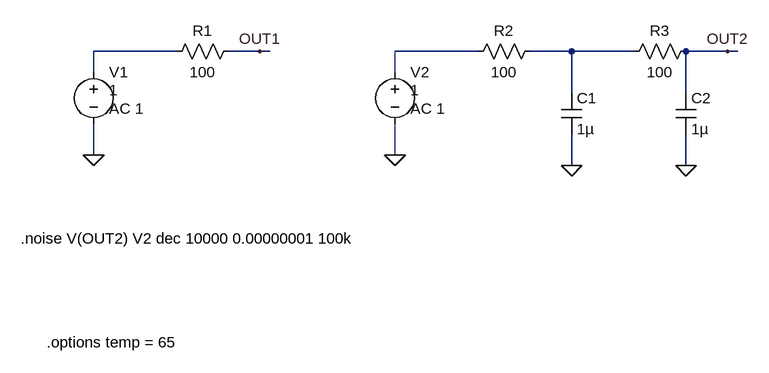
[diagram p0: schematic ask2_2.asc]
ask2_2.asc, the LTspice schematic file:
Version 4
SHEET 1 1024 680
WIRE 128 112 0 112
WIRE 256 112 208 112
WIRE 272 112 256 112
WIRE 592 112 464 112
WIRE 736 112 672 112
WIRE 832 112 736 112
WIRE 976 112 912 112
WIRE 992 112 976 112
WIRE 0 144 0 112
WIRE 464 144 464 112
WIRE 736 176 736 112
WIRE 912 176 912 112
WIRE 0 272 0 224
WIRE 464 272 464 224
WIRE 736 288 736 240
WIRE 912 288 912 240
FLAG 256 112 OUT1
FLAG 0 272 0
FLAG 464 272 0
FLAG 976 112 OUT2
FLAG 736 288 0
FLAG 912 288 0
SYMBOL voltage 0 128 R0
WINDOW 3 24 44 Left 2
WINDOW 123 24 72 Left 2
WINDOW 39 0 0 Left 0
SYMATTR InstName V1
SYMATTR Value 1
SYMATTR Value2 AC 1
SYMBOL res 224 96 R90
WINDOW 0 0 56 VBottom 2
WINDOW 3 32 56 VTop 2
SYMATTR InstName R1
SYMATTR Value 100
SYMBOL voltage 464 128 R0
WINDOW 3 24 44 Left 2
WINDOW 123 24 72 Left 2
WINDOW 39 0 0 Left 0
SYMATTR InstName V2
SYMATTR Value 1
SYMATTR Value2 AC 1
SYMBOL res 688 96 R90
WINDOW 0 0 56 VBottom 2
WINDOW 3 32 56 VTop 2
SYMATTR InstName R2
SYMATTR Value 100
SYMBOL cap 720 176 R0
SYMATTR InstName C1
SYMATTR Value 1µ
SYMBOL res 928 96 R90
WINDOW 0 0 56 VBottom 2
WINDOW 3 32 56 VTop 2
SYMATTR InstName R3
SYMATTR Value 100
SYMBOL cap 896 176 R0
SYMATTR InstName C2
SYMATTR Value 1µ
TEXT -112 400 Left 2 !.noise V(OUT2) V2 dec 10000 0.00000001 100k
TEXT -72 560 Left 2 !.options temp = 65

The netlist it stands for:
* ask2_2.asc
V1 N001 0 1 AC 1
R1 OUT1 N001 100
V2 N002 0 1 AC 1
R2 N003 N002 100
C1 N003 0 1µ
R3 OUT2 N003 100
C2 OUT2 0 1µ
.noise V(OUT2) V2 dec 10000 0.00000001 100k
.options temp = 65
.backanno
.end